# Altium schematic sheet DC_DC_15V_AND_VAR.SchDoc
size Tabloid; Date: Date; Author: Author 1; DocumentNumber: 6; Revision: 1; SheetNumber: 6; SheetTotal: 7; Size: 11x17; Sheet_Name: 15V and Variable V
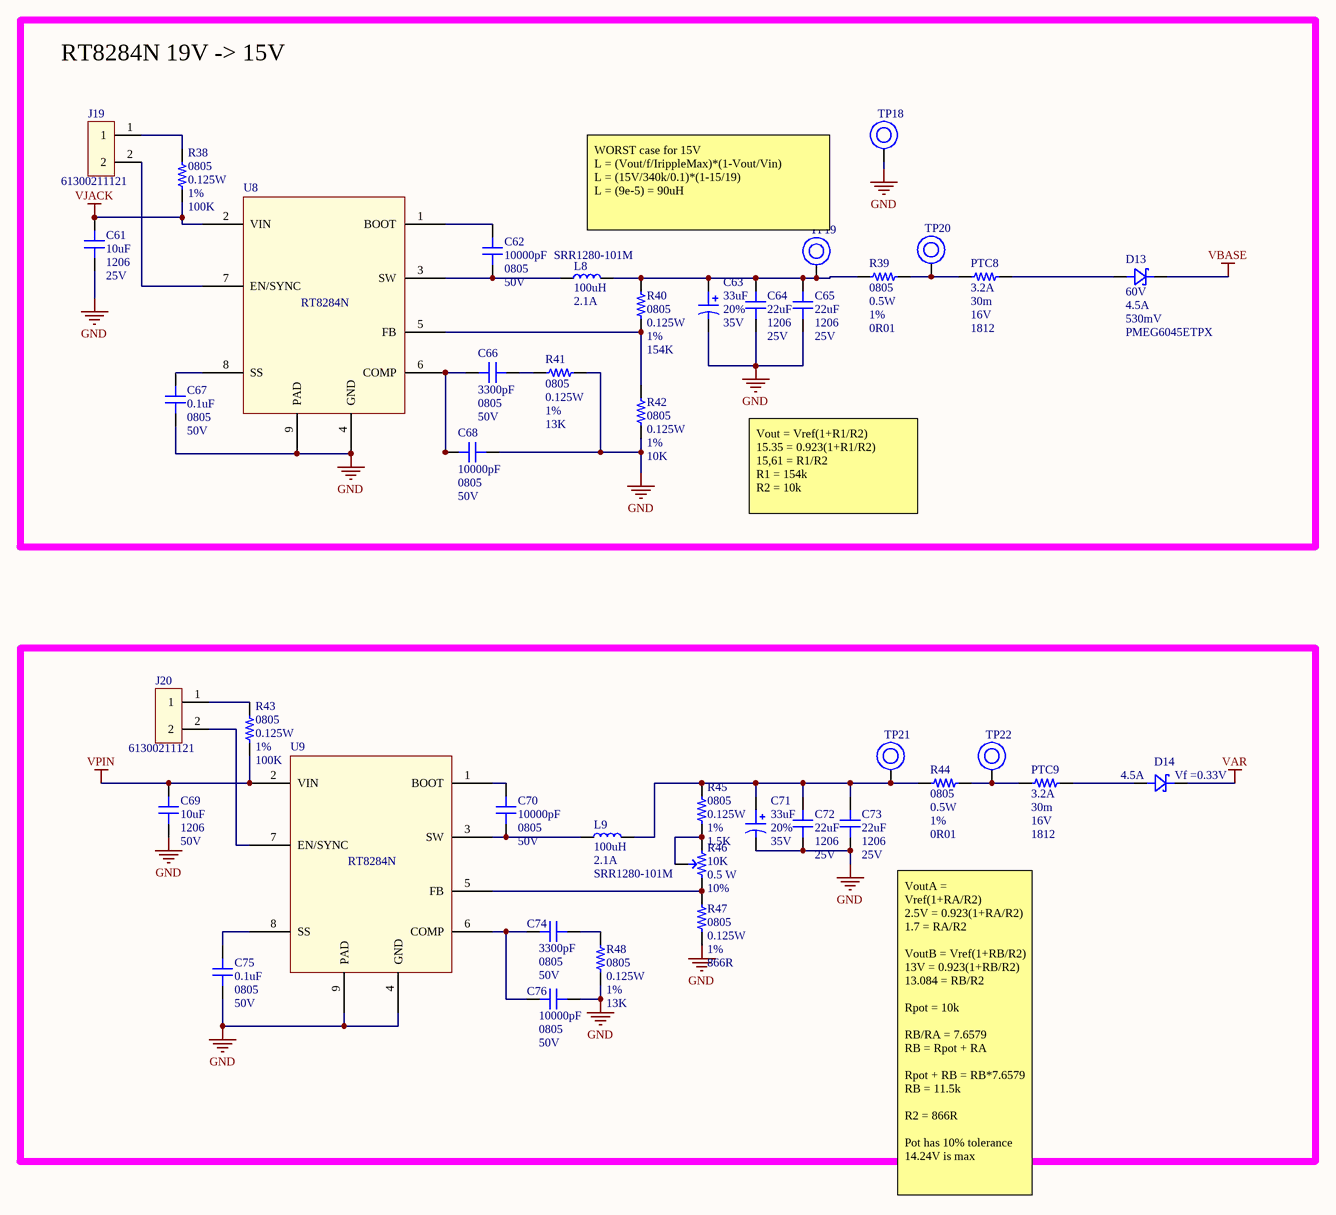
[diagram p0: DC_DC_15V_AND_VAR.SchDoc]

## Parts
C61  value 10uF  Package: 1206  Voltage: 25V  [CAP_1206]  (hidden comment: CAP_‎CL31A106KAHNFNE‎)
C62  value 10000pF  Package: 0805  Voltage: 50V  [CAP_0805]  (hidden comment: CAP_‎‎‎‎CL21B103KBANNNC)
C63  value 33uF  Tolerance: 20%  Voltage: 35V  [CAP ALU - 6.3mm DIA]  (hidden comment: CAP_EEE-FK1V330P)
C64  value 22uF  Package: 1206  Voltage: 25V  [CAP_1206]  (hidden comment: CAP_‎‎CL31A226KAHNNNE‎)
C65  value 22uF  Package: 1206  Voltage: 25V  [CAP_1206]  (hidden comment: CAP_‎‎CL31A226KAHNNNE‎)
C66  value 3300pF  Package: 0805  Voltage: 50V  [CAP_0805]  (hidden comment: CAP_CL21B332KBANNNC‎)
C67  value 0.1uF  Package: 0805  Voltage: 50V  [CAP_0805]  (hidden comment: CAP_CC0805KRX7R9BB104‎)
C68  value 10000pF  Package: 0805  Voltage: 50V  [CAP_0805]  (hidden comment: CAP_‎‎‎‎CL21B103KBANNNC)
C69  value 10uF  Package: 1206  Voltage: 50V  [CAP_1206]  (hidden comment: CAP_GRT31CR61H106ME01L‎)
C70  value 10000pF  Package: 0805  Voltage: 50V  [CAP_0805]  (hidden comment: CAP_‎‎‎‎CL21B103KBANNNC)
C71  value 33uF  Tolerance: 20%  Voltage: 35V  [CAP ALU - 6.3mm DIA]  (hidden comment: CAP_EEE-FK1V330P)
C72  value 22uF  Package: 1206  Voltage: 25V  [CAP_1206]  (hidden comment: CAP_‎‎CL31A226KAHNNNE‎)
C73  value 22uF  Package: 1206  Voltage: 25V  [CAP_1206]  (hidden comment: CAP_‎‎CL31A226KAHNNNE‎)
C74  value 3300pF  Package: 0805  Voltage: 50V  [CAP_0805]  (hidden comment: CAP_CL21B332KBANNNC‎)
C75  value 0.1uF  Package: 0805  Voltage: 50V  [CAP_0805]  (hidden comment: CAP_CC0805KRX7R9BB104‎)
C76  value 10000pF  Package: 0805  Voltage: 50V  [CAP_0805]  (hidden comment: CAP_‎‎‎‎CL21B103KBANNNC)
D13  Voltage: 60V  Current: 4.5A  Vf: 530mV  Part number: PMEG6045ETPX  [DO-214AC_SOD128]  (hidden comment: DIODE_SCH_PMEG6045ETPX)
D14  Current: 4.5A  Vf: Vf =0.33V  [DO-214AC_SOD128]  (hidden comment: SCHOTTKEY)
J19  Part number: 61300211121  [HDR1X2]  (hidden comment: Header 2 pin SM)
J20  Part number: 61300211121  [HDR1X2]  (hidden comment: Header 2 pin SM)
L8  value 100uH  Current: 2.1A  Part number: SRR1280-101M  [BOURNS 12.5x12.5mm]  (hidden comment: IND_SRR1280-101M)
L9  value 100uH  Current: 2.1A  Part number: SRR1280-101M  [BOURNS 12.5x12.5mm]  (hidden comment: IND_SRR1280-101M)
PTC8  Trip value: 3.2A  Res: 30m  Voltage: 16V  Package: 1812  [PTC - 1812]  (hidden comment: PTC_0ZCG0160BF2C)
PTC9  Trip value: 3.2A  Res: 30m  Voltage: 16V  Package: 1812  [PTC - 1812]  (hidden comment: PTC_0ZCG0160BF2C)
R38  value 100K  Package: 0805  Power: 0.125W  Tolerance: 1%  [RES_0805]  (hidden comment: RES_‎RMCF0805FT100K‎)
R39  value 0R01  Package: 0805  Power: 0.5W  Tolerance: 1%  [RES_0805]  (hidden comment: RES_‎‎‎‎‎ KRL1220E-M-R010-F-T5)
R40  value 154K  Package: 0805  Power: 0.125W  Tolerance: 1%  [RES_0805]  (hidden comment: RES_‎‎RC0805FR-07154KL)
R41  value 13K  Package: 0805  Power: 0.125W  Tolerance: 1%  [RES_0805]  (hidden comment: RES_‎ RC0805FR-0713KL)
R42  value 10K  Package: 0805  Power: 0.125W  Tolerance: 1%  [RES_0805]  (hidden comment: RES_‎RMCF0805FT10K0)
R43  value 100K  Package: 0805  Power: 0.125W  Tolerance: 1%  [RES_0805]  (hidden comment: RES_‎RMCF0805FT100K‎)
R44  value 0R01  Package: 0805  Power: 0.5W  Tolerance: 1%  [RES_0805]  (hidden comment: RES_‎‎‎‎‎ KRL1220E-M-R010-F-T5)
R45  value 1.5K  Package: 0805  Power: 0.125W  Tolerance: 1%  [RES_0805]  (hidden comment: RES_‎‎‎‎CRCW08051K50FKEAC)
R46  value 10K  Watt: 0.5 W  Tolerance: 10%  [3361P]  (hidden comment: POT_3361P-1-103GLF)
R47  value 866R  Package: 0805  Power: 0.125W  Tolerance: 1%  [RES_0805]  (hidden comment: RES_‎‎‎RC0805FR-07866RL)
R48  value 13K  Package: 0805  Power: 0.125W  Tolerance: 1%  [RES_0805]  (hidden comment: RES_‎ RC0805FR-0713KL)
TP18  TestPoint 3x3mm  [TestPoint 3X3mm]  (value not drawn)
TP19  TestPoint 3x3mm  [TestPoint 3X3mm]  (value not drawn)
TP20  TestPoint 3x3mm  [TestPoint 3X3mm]  (value not drawn)
TP21  TestPoint 3x3mm  [TestPoint 3X3mm]  (value not drawn)
TP22  TestPoint 3x3mm  [TestPoint 3X3mm]  (value not drawn)
U8  REG_SW_RT8284N  [SOP8]  (value not drawn)
U9  REG_SW_RT8284N  [SOP8]  (value not drawn)

## Blocks framed on the sheet
RT8284N 19V -> 15V: C61-C68 D13 J19 L8 PTC8 R38-R42 TP18-TP20 U8

## Nets
GND: C61.2 C63.2 C64.2 C65.2 C67.2 C68.2 C69.2 C71.2 C72.2 C73.2 C75.2 C76.2 R41.1 R42.2 R47.2 R48.2 TP18.1 U8.4(GND) U8.9(PAD) U9.4(GND) U9.9(PAD)
VAR: D14.2
VBASE: D13.2
VJACK: C61.1 R38.2 U8.2(VIN)
VPIN: C69.1 R43.2 U9.2(VIN)
NetC62_1: C62.1 U8.1(BOOT)
NetC62_2: C62.2 L8.1 U8.3(SW)
NetC63_1: C63.1 C64.1 C65.1 L8.2 R39.1 R40.1 TP19.1
NetC66_1: C66.1 C68.1 U8.6(COMP)
NetC66_2: C66.2 R41.2
NetC67_1: C67.1 U8.8(SS)
NetC70_1: C70.1 U9.1(BOOT)
NetC70_2: C70.2 L9.1 U9.3(SW)
NetC71_1: C71.1 C72.1 C73.1 L9.2 R44.1 R45.1 TP21.1
NetC74_1: C74.1 C76.1 U9.6(COMP)
NetC74_2: C74.2 R48.1
NetC75_1: C75.1 U9.8(SS)
NetD13_1: D13.1 PTC8.2
NetD14_1: D14.1 PTC9.2
NetJ19_1: J19.1 R38.1
NetJ19_2: J19.2 U8.7(EN/SYNC)
NetJ20_1: J20.1 R43.1
NetJ20_2: J20.2 U9.7(EN/SYNC)
NetPTC8_1: PTC8.1 R39.2 TP20.1
NetPTC9_1: PTC9.1 R44.2 TP22.1
NetR40_2: R40.2 R42.1 U8.5(FB)
NetR45_2: R45.2 R46.1 R46.3
NetR46_2: R46.2 R47.1 U9.5(FB)

## Notes on the sheet
- WORST case for 15V
  L = (Vout/f/IrippleMax)*(1-Vout/Vin)
  L = (15V/340k/0.1)*(1-15/19)
  L = (9e-5) = 90uH
- Vout = Vref(1+R1/R2)
  15.35 = 0.923(1+R1/R2)
  15,61 = R1/R2
  R1 = 154k
  R2 = 10k
- VoutA = Vref(1+RA/R2)
  2.5V = 0.923(1+RA/R2)
  1.7 = RA/R2
  VoutB = Vref(1+RB/R2)
  13V = 0.923(1+RB/R2)
  13.084 = RB/R2
  Rpot = 10k
  RB/RA = 7.6579
  RB = Rpot + RA
  Rpot + RB = RB*7.6579
  RB = 11.5k
  R2 = 866R
  Pot has 10% tolerance
  14.24V is max
- Sheet Name
- Project Title
- Global Project
- Size
- Group
- Revision
- Date
- Sheet
- of
- Filename
- Designers

## Library data of the parts
C61 = CAP_‎CL31A106KAHNFNE‎: CAP CER 10uF 25V 1206; Part number: CL31A106KAHNFNE‎
C62 C68 C70 C76 = CAP_‎‎‎‎CL21B103KBANNNC: CAP CER 10000pF 50V 0805; Part number: ‎CL21B103KBANNNC
C63 C71 = CAP_EEE-FK1V330P: CAP ALU 33µF 35V; Part number: EEE-FK1V330P; Package: 6.30mm
C64 C65 C72 C73 = CAP_‎‎CL31A226KAHNNNE‎: CAP CER 22uF 25V 1206; Part number: CL31A226KAHNNNE‎
C66 C74 = CAP_CL21B332KBANNNC‎: CAP CER 3300pF 50V 0805; Part number: CL21B332KBANNNC‎
C67 C75 = CAP_CC0805KRX7R9BB104‎: CAP CER 0.1uF 50V 0805; Part number: CC0805KRX7R9BB104‎
C69 = CAP_GRT31CR61H106ME01L‎: CAP CER 10uF 50V 1206; Part number: GRT31CR61H106ME01L‎
D13 = DIODE_SCH_PMEG6045ETPX: Diode Schottky 60V 4.5A Surface Mount CFP5; Package: SOD-128
D14 = SCHOTTKEY: Part number: PMEG6045ETPX
L8 L9 = IND_SRR1280-101M: IND 100µH Shielded Wirewound Inductor 2.1A; Tolerance: 20%; Package: Nonstandard
PTC8 PTC9 = PTC_0ZCG0160BF2C: PTC_Polymeric PTC Resettable Fuse 16V 1.6A Ih; Part number: 0ZCG0160BF2C
R38 R43 = RES_‎RMCF0805FT100K‎: RES 100K 1% 1/8W 0805; Part number: ‎RMCF0805FT100K‎
R39 R44 = RES_‎‎‎‎‎ KRL1220E-M-R010-F-T5: RES 0.01R 1% 1/2W 0805; Part number: KRL1220E-M-R010-F-T5
R40 = RES_‎‎RC0805FR-07154KL: RES 154K 1% 1/8W 0805; Part number: ‎RC0805FR-07154KL
R41 R48 = RES_‎ RC0805FR-0713KL: RES 13K 1% 1/8W 0805; Part number: RC0805FR-0713KL
R42 = RES_‎RMCF0805FT10K0: RES 10K 1% 1/8W 0805; Part number: RMCF0805FT10K0
R45 = RES_‎‎‎‎CRCW08051K50FKEAC: RES 1.5K 1% 1/8W 0805; Part number: CRCW08051K50FKEAC
R46 = POT_3361P-1-103GLF: POT TRIMMER 10K OHM 0.5W GW TOP ADJ; Part number: 3361P-1-103GLF; Package: 7.04mm x 6.71mm x 5.21mm
R47 = RES_‎‎‎RC0805FR-07866RL: RES 866R 1% 1/8W 0805; Part number: RC0805FR-07866RL
U8 U9 = REG_SW_RT8284N: REG 2A, 23V, 340kHz Synchronous Step-Down Converter; Part number: RT8284N